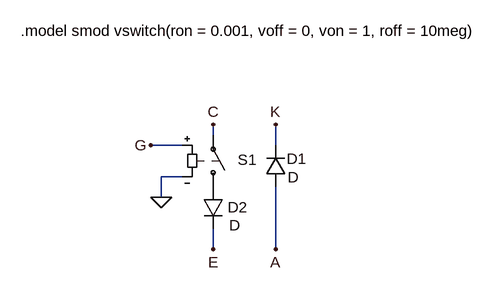
[diagram p0: schematic IDEAL_IGBT.asc]
IDEAL_IGBT.asc, the LTspice schematic file:
Version 4
SHEET 1 880 680
WIRE 208 80 208 64
WIRE 160 96 112 96
WIRE 304 96 304 64
WIRE 160 144 128 144
WIRE 128 176 128 144
WIRE 208 256 208 224
WIRE 304 256 304 160
FLAG 112 96 G
FLAG 208 64 C
FLAG 304 64 K
FLAG 208 256 E
FLAG 128 176 0
FLAG 304 256 A
SYMBOL sw 208 176 M180
WINDOW 3 24 104 Invisible 0
WINDOW 0 38 58 Left 0
SYMATTR Value smod
SYMATTR InstName S1
SYMBOL diode 320 160 R180
WINDOW 0 -32 43 Left 0
WINDOW 3 -20 15 Left 0
SYMATTR InstName D1
SYMBOL diode 192 160 R0
WINDOW 0 38 31 Left 0
WINDOW 3 41 59 Left 0
SYMATTR InstName D2
TEXT -88 -80 Left 0 !.model smod vswitch(ron = 0.001, voff = 0, von = 1, roff = 10meg)

The netlist it stands for:
* IDEAL_IGBT.asc
S1 P001 C G 0 smod
D1 A K D
D2 P001 E D
.model D D
.lib standard.dio
.model smod vswitch(ron = 0.001, voff = 0, von = 1, roff = 10meg)
.backanno
.end